# Altium schematic sheet Sheet1.SchDoc
size A4; SheetNumber: 1; SheetTotal: 1
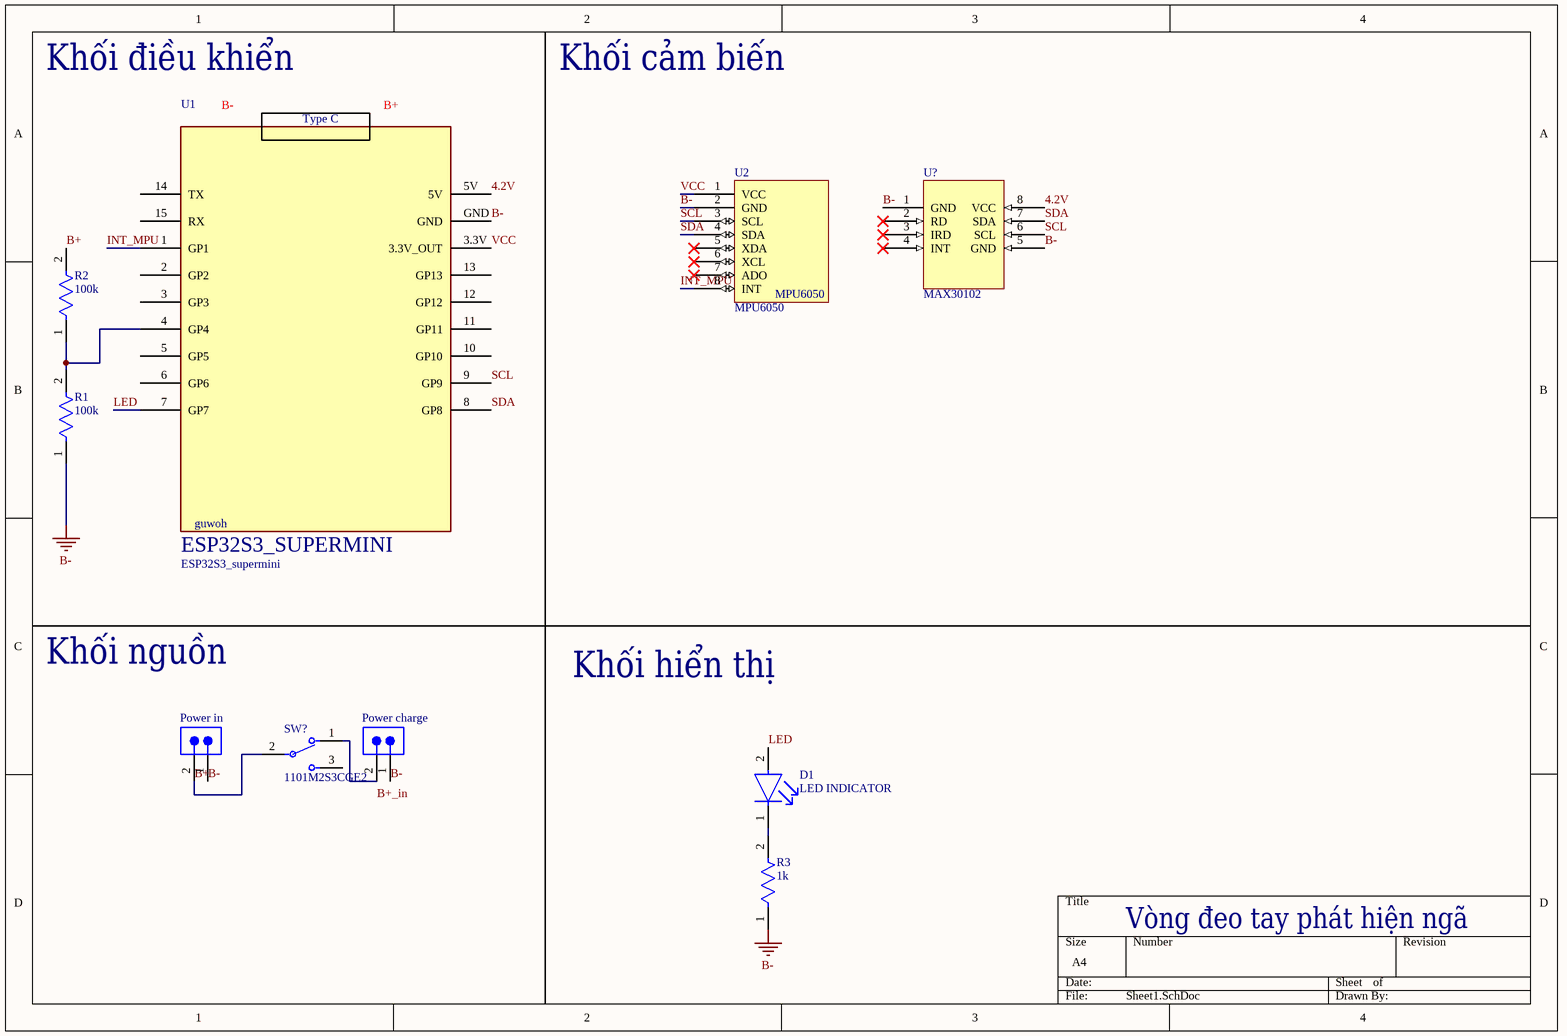
[diagram p0: Sheet1.SchDoc]

## Parts
D1  LED INDICATOR  [FP-APHD1608LZGCK-MFG]
Power_charge  (no value)  [SMTC-TSW-102-26-XX-S]
Power_in  (no value)  [SMTC-TSW-102-26-XX-S]
R1  100k  [FP-MCA1206-IPC_B]
R2  100k  [FP-MCA1206-IPC_B]
R3  1k  [FP-TFCR0805-IPC_C]
SW?  1101M2S3CGE2  [FP-1101M2S3CGE2-MFG]
U1  ESP32S3_supermini  [PCBComponent_1]
U2  MPU6050  [U?]
U?  MAX30102  [PCBComponent_1]

## Nets
B-: Power_charge.1 Power_in.1 R1.1 R3.1 U1.GND U2.2(GND) U?.1(GND) U?.5(GND)
4.2V: U1.5V U?.8(VCC)
B+: Power_in.2 R2.2 SW?.2(COMM)
INT_MPU: U1.1(GP1) U2.8(INT)
LED: D1.2(A) U1.7(GP7)
SCL: U1.9(GP9) U2.3(SCL) U?.6(SCL)
SDA: U1.8(GP8) U2.4(SDA) U?.7(SDA)
VCC: U1.3.3V(3.3V_OUT) U2.1(VCC)
NetD1_1: D1.1(C) R3.2
NetPower_charge_2: Power_charge.2 SW?.1
NetR1_2: R1.2 R2.1 U1.4(GP4)

Not connected (* = marked no-connect by the designer): SW? 3; U1 2(GP2) 3(GP3) 5(GP5) 6(GP6) 10(GP10) 11(GP11) 12(GP12) 13(GP13) 14(TX) 15(RX); U2 5(XDA)* 6(XCL)* 7(ADO)*; U? 2(RD)* 3(IRD)* 4(INT)*

## Notes on the sheet
- Khối điều khiển
- B-
- B+
- Khối cảm biến
- Khối nguồn
- Khối hiển thị
- Vòng đeo tay phát hiện ngã
- Labels drawn without touching a wire or pin: B+_in
- (in symbol ESP32S3_supermini) Type C; guwoh; ESP32S3_SUPERMINI

## Library data of the parts
D1 = CMP-44529-000045-1: LED GREEN CLEAR 1608 SMD; Test Current: 2mA; Dominant Wavelength: 525nm; Lens Color: Colorless; Luminous Intensity: 180mcd; Viewing Angle: 100°; Forward Voltage: 2.65V; Lens Size: 0.7mm; Lens Style: Round; Mount: Surface Mount; Packaging: Tape and Reel; Lens Transparency: Clear; Height: 0.75mm; Case/Package: 0603; Length: 1.6mm; Case Code (Metric): 1608; Width: 0.8mm; Color: Green; Case Code (Imperial): 0603
Power_charge Power_in = CMP-1024-00327-1: 0.025" SQ Post Header, Through-hole, Vertical, -55 to 125 degC, 2.54 mm Pitch, 2-Pin, Male, RoHS; PartNumber: TSW-102-26-G-S; Manufacturer: Samtec; Pitch: 2.54 mm; Orientation: Vertical; ComponentLink3Description: Package Specification; PackageReference: TSW-102-26-XX-S; Mounting Technology: Through-hole; ComponentLink2Description: Datasheet; ComponentLink1URL: http://www.samtec.com; DatasheetVersion: F-214; ComponentLink1Description: Manufacturer URL; RoHS: True; ComponentLink2URL: http://www.samtec.com/documents/webfiles/pdf/TSW_TH.PDF; ComponentLink3URL: http://www.samtec.com/documents/webfiles/cpdf/TSW-XXX-XX-XXX-X-XX-XXX-MKT.pdf; PackageDescription: .025[0.64] SQ. Post Terminal Strip Assembly; PackageVersion: DM, 8/1988; Temperature Range: -55 to 125 degC
R1 R2 = CMP-02407-011266-1: Res MC AT Professional Thin Film 1206 10kΩ 0.5% 0.4W ±25ppm/°C Molded Paper T/R; Resistance: 10kR; Voltage Rating: 200V; Max Power Dissipation: 400mW; Weight: 0.000325oz; Height: 0.55mm; Case Code (Imperial): 1206; Packaging: Tape and Reel; Series: MCA AT - Professional; Width: 1.6mm; Resistor Type: Thin Film; Tolerance: 0.5%; Max Operating Temperature: 175°C; Termination: SMD/SMT; Min Operating Temperature: -55°C; Temperature Coefficient: 25ppm/°C; Number of Terminations: 2; Length: 3.2mm; RoHS Compliant: Yes; Case Code (Metric): 3216; Case/Package: 1206; Features: Automotive AEC-Q200; Power Rating: 400mW
R3 = CMP-250906-253940-1: RES Thin Film,  60.4Ω, 0.5%, 0.125W, 25ppm/°C, 0805
SW? = CMP-10038-000004-1: SWITCH SLIDE SPDT 6A 120V; Manufacturer: C&K Components; Contact Resistance: 10mΩ; Voltage Rating Dc: 28V; Electromechanical Life: 40000Cycles; Octopart: https://octopart.com/1101m2s3cge2-c%26k+components-2817222; Temperature Range Low: -30°C; Automotive: No; Device Class L2: Switches; RoHS: TRUE; Device Class L3: Slide Switches; Throw Configuration: SPDT; Temperature Range High: +65°C; Mouser Description: Switch Slide ON None ON SPDT Top Slide 6A 250VAC 28VDC 0.4VA PC Pins Thru-Hole Bulk; Contact Current Rating: 6A; Temperature: -30°C to +65°C; Manufacturer Part Number: 1101M2S3CGE2; ComponentLink2Description: Datasheet; Lead Free: Yes; Package: 1101M2S3CGE2; Height: 13.34mm; Voltage Rating Ac: 120V; Digikey Description: SWITCH SLIDE SPDT 6A 120V; ComponentLink2URL: https://www.ckswitches.com/media/1429/1000.pdf; Device Class L1: Electromechanical; Category: Switch; Mount: Through Hole